# Altium schematic sheet TSK3000_Trace.SchDoc: FPGA TSK3000 Trace example
size B; Organization: Altium Limited; Address1: L3, 12a Rodborough Rd; Address2: Frenchs Forest; Address3: NSW; Address4: Australia 2086
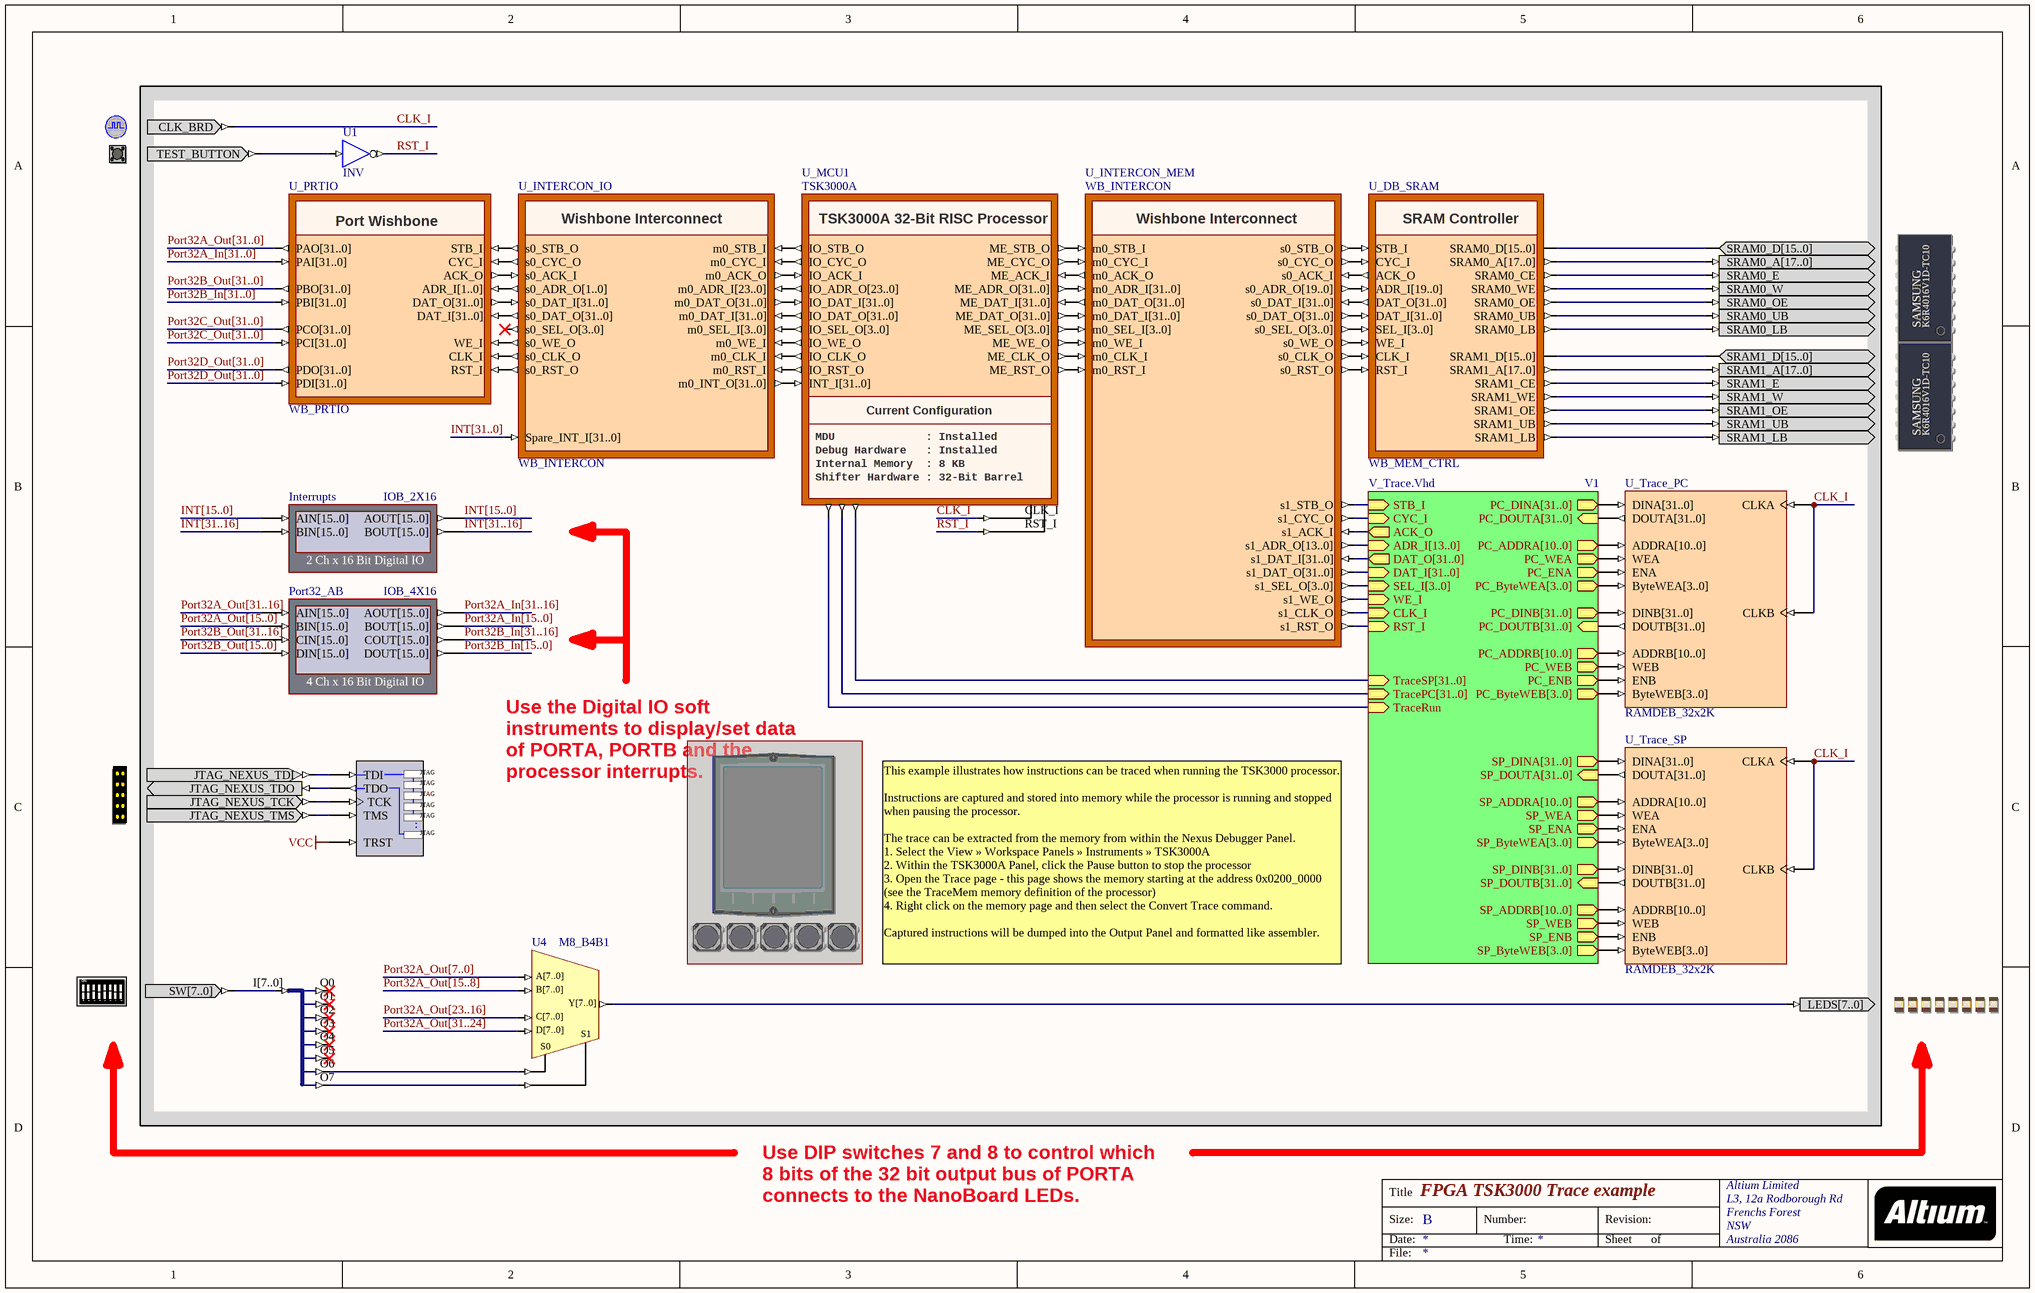
[diagram p0: TSK3000_Trace.SchDoc]

## Parts
(Parts that share a designator on the sheet are numbered #1, #2 ... from top to bottom, then left to right.)
?#1  CLOCK_BOARD  (value not drawn)
?#2  TEST_BUTTON  (value not drawn)
?#3  SRAM_DAUGHTER0  (value not drawn)
?#4  SRAM_DAUGHTER1  (value not drawn)
?#5  FIRMWARE_TFT_ENABLE  (value not drawn)  (masked out: inside a compile mask, not in the netlist)
?#6  NEXUS_JTAG_CONNECTOR  (value not drawn)
?#7  FIRMWARE_BUTTONS_ENABLE  (value not drawn)  (masked out: inside a compile mask, not in the netlist)
?#8  DIPSWITCH  (value not drawn)
?#9  LED  (value not drawn)
Interrupts  IOB_2X16
NEXUS_JTAG_PORT  NEXUS_JTAG_PORT  (value not drawn)
Port32_AB  IOB_4X16
U1  INV
U4  M8_B4B1
U11  J8B_8S  (value not drawn)
U_DB_SRAM  WB_MEM_CTRL
U_INTERCON_IO  WB_INTERCON
U_INTERCON_MEM  WB_INTERCON
U_MCU1  TSK3000A
U_PRTIO  WB_PRTIO
U_Trace_PC  RAMDEB_32x2K
U_Trace_SP  RAMDEB_32x2K

## Sub-sheets
V1 = V_Trace.Vhd: TracePC[31..0] (in), TraceRun (in), PC_DOUTA[31..0] (in), PC_DOUTB[31..0] (in), PC_ADDRA[10..0] (out), PC_ADDRB[10..0] (out), PC_DINA[31..0] (out), PC_DINB[31..0] (out), PC_WEA (out), PC_WEB (out), PC_ENA (out), PC_ENB (out), PC_ByteWEA[3..0] (out), PC_ByteWEB[3..0] (out), TraceSP[31..0] (in), SP_DOUTA[31..0] (in), SP_DINA[31..0] (out), SP_ByteWEB[3..0] (out), SP_DINB[31..0] (out), SP_ByteWEA[3..0] (out), SP_ENA (out), SP_WEB (out), SP_ENB (out), SP_DOUTB[31..0] (in), SP_ADDRB[10..0] (out), SP_WEA (out), SP_ADDRA[10..0] (out), SEL_I[3..0] (in), WE_I (in), DAT_O[31..0] (out), DAT_I[31..0] (in), ADR_I[13..0] (in), ACK_O (out), STB_I (in), CYC_I (in), RST_I (in), CLK_I (in)

## Nets
VCC: NEXUS_JTAG_PORT.TRST
CLK_I: ?#1.CLK_BRD U_MCU1.CLK_I U_Trace_PC.CLKA U_Trace_PC.CLKB U_Trace_SP.CLKA U_Trace_SP.CLKB
INT[15..0]: Interrupts.AIN[15..0] Interrupts.AOUT[15..0]
INT[31..0]: U_INTERCON_IO.Spare_INT_I[31..0]
INT[31..16]: Interrupts.BIN[15..0] Interrupts.BOUT[15..0]
Port32A_In[15..0]: Port32_AB.BOUT[15..0]
Port32A_In[31..0]: U_PRTIO.PAI[31..0]
Port32A_In[31..16]: Port32_AB.AOUT[15..0]
Port32A_Out[7..0]: U4.A[7..0]
Port32A_Out[15..0]: Port32_AB.BIN[15..0]
Port32A_Out[15..8]: U4.B[7..0]
Port32A_Out[23..16]: U4.C[7..0]
Port32A_Out[31..0]: U_PRTIO.PAO[31..0]
Port32A_Out[31..16]: Port32_AB.AIN[15..0]
Port32A_Out[31..24]: U4.D[7..0]
Port32B_In[15..0]: Port32_AB.DOUT[15..0]
Port32B_In[31..0]: U_PRTIO.PBI[31..0]
Port32B_In[31..16]: Port32_AB.COUT[15..0]
Port32B_Out[15..0]: Port32_AB.DIN[15..0]
Port32B_Out[31..0]: U_PRTIO.PBO[31..0]
Port32B_Out[31..16]: Port32_AB.CIN[15..0]
Port32C_Out[31..0]: U_PRTIO.PCI[31..0] U_PRTIO.PCO[31..0]
Port32D_Out[31..0]: U_PRTIO.PDI[31..0] U_PRTIO.PDO[31..0]
RST_I: U1.O U_MCU1.RST_I
Net?#2_TEST_BUTTON: ?#2.TEST_BUTTON U1.I
Net?#3_SRAM0_A[17..0]: ?#3.SRAM0_A[17..0] U_DB_SRAM.SRAM0_A[17..0]
Net?#3_SRAM0_D[15..0]: ?#3.SRAM0_D[15..0] U_DB_SRAM.SRAM0_D[15..0]
Net?#3_SRAM0_E: ?#3.SRAM0_E U_DB_SRAM.SRAM0_CE
Net?#3_SRAM0_LB: ?#3.SRAM0_LB U_DB_SRAM.SRAM0_LB
Net?#3_SRAM0_OE: ?#3.SRAM0_OE U_DB_SRAM.SRAM0_OE
Net?#3_SRAM0_UB: ?#3.SRAM0_UB U_DB_SRAM.SRAM0_UB
Net?#3_SRAM0_W: ?#3.SRAM0_W U_DB_SRAM.SRAM0_WE
Net?#4_SRAM1_A[17..0]: ?#4.SRAM1_A[17..0] U_DB_SRAM.SRAM1_A[17..0]
Net?#4_SRAM1_D[15..0]: ?#4.SRAM1_D[15..0] U_DB_SRAM.SRAM1_D[15..0]
Net?#4_SRAM1_E: ?#4.SRAM1_E U_DB_SRAM.SRAM1_CE
Net?#4_SRAM1_LB: ?#4.SRAM1_LB U_DB_SRAM.SRAM1_LB
Net?#4_SRAM1_OE: ?#4.SRAM1_OE U_DB_SRAM.SRAM1_OE
Net?#4_SRAM1_UB: ?#4.SRAM1_UB U_DB_SRAM.SRAM1_UB
Net?#4_SRAM1_W: ?#4.SRAM1_W U_DB_SRAM.SRAM1_WE
Net?#6_JTAG_NEXUS_TCK: ?#6.JTAG_NEXUS_TCK NEXUS_JTAG_PORT.TCK
Net?#6_JTAG_NEXUS_TDI: ?#6.JTAG_NEXUS_TDI NEXUS_JTAG_PORT.TDI
Net?#6_JTAG_NEXUS_TDO: ?#6.JTAG_NEXUS_TDO NEXUS_JTAG_PORT.TDO
Net?#6_JTAG_NEXUS_TMS: ?#6.JTAG_NEXUS_TMS NEXUS_JTAG_PORT.TMS
Net?#8_SW[7..0]: ?#8.SW[7..0] U11.I[7..0]
Net?#9_LEDS[7..0]: ?#9.LEDS[7..0] U4.Y[7..0]
NetU4_S0: U4.S0 U11.O6
NetU4_S1: U4.S1 U11.O7
NetU_DB_SRAM_ACK_O: U_DB_SRAM.ACK_O U_INTERCON_MEM.s0_ACK_I
NetU_DB_SRAM_ADR_I[19..0]: U_DB_SRAM.ADR_I[19..0] U_INTERCON_MEM.s0_ADR_O[19..0]
NetU_DB_SRAM_CLK_I: U_DB_SRAM.CLK_I U_INTERCON_MEM.s0_CLK_O
NetU_DB_SRAM_CYC_I: U_DB_SRAM.CYC_I U_INTERCON_MEM.s0_CYC_O
NetU_DB_SRAM_DAT_I[31..0]: U_DB_SRAM.DAT_I[31..0] U_INTERCON_MEM.s0_DAT_O[31..0]
NetU_DB_SRAM_DAT_O[31..0]: U_DB_SRAM.DAT_O[31..0] U_INTERCON_MEM.s0_DAT_I[31..0]
NetU_DB_SRAM_RST_I: U_DB_SRAM.RST_I U_INTERCON_MEM.s0_RST_O
NetU_DB_SRAM_SEL_I[3..0]: U_DB_SRAM.SEL_I[3..0] U_INTERCON_MEM.s0_SEL_O[3..0]
NetU_DB_SRAM_STB_I: U_DB_SRAM.STB_I U_INTERCON_MEM.s0_STB_O
NetU_DB_SRAM_WE_I: U_DB_SRAM.WE_I U_INTERCON_MEM.s0_WE_O
NetU_INTERCON_IO_m0_ACK_O: U_INTERCON_IO.m0_ACK_O U_MCU1.IO_ACK_I
NetU_INTERCON_IO_m0_ADR_I[23..0]: U_INTERCON_IO.m0_ADR_I[23..0] U_MCU1.IO_ADR_O[23..0]
NetU_INTERCON_IO_m0_CLK_I: U_INTERCON_IO.m0_CLK_I U_MCU1.IO_CLK_O
NetU_INTERCON_IO_m0_CYC_I: U_INTERCON_IO.m0_CYC_I U_MCU1.IO_CYC_O
NetU_INTERCON_IO_m0_DAT_I[31..0]: U_INTERCON_IO.m0_DAT_I[31..0] U_MCU1.IO_DAT_O[31..0]
NetU_INTERCON_IO_m0_DAT_O[31..0]: U_INTERCON_IO.m0_DAT_O[31..0] U_MCU1.IO_DAT_I[31..0]
NetU_INTERCON_IO_m0_INT_O[31..0]: U_INTERCON_IO.m0_INT_O[31..0] U_MCU1.INT_I[31..0]
NetU_INTERCON_IO_m0_RST_I: U_INTERCON_IO.m0_RST_I U_MCU1.IO_RST_O
NetU_INTERCON_IO_m0_SEL_I[3..0]: U_INTERCON_IO.m0_SEL_I[3..0] U_MCU1.IO_SEL_O[3..0]
NetU_INTERCON_IO_m0_STB_I: U_INTERCON_IO.m0_STB_I U_MCU1.IO_STB_O
NetU_INTERCON_IO_m0_WE_I: U_INTERCON_IO.m0_WE_I U_MCU1.IO_WE_O
NetU_INTERCON_IO_s0_ACK_I: U_INTERCON_IO.s0_ACK_I U_PRTIO.ACK_O
NetU_INTERCON_IO_s0_ADR_O[1..0]: U_INTERCON_IO.s0_ADR_O[1..0] U_PRTIO.ADR_I[1..0]
NetU_INTERCON_IO_s0_CLK_O: U_INTERCON_IO.s0_CLK_O U_PRTIO.CLK_I
NetU_INTERCON_IO_s0_CYC_O: U_INTERCON_IO.s0_CYC_O U_PRTIO.CYC_I
NetU_INTERCON_IO_s0_DAT_I[31..0]: U_INTERCON_IO.s0_DAT_I[31..0] U_PRTIO.DAT_O[31..0]
NetU_INTERCON_IO_s0_DAT_O[31..0]: U_INTERCON_IO.s0_DAT_O[31..0] U_PRTIO.DAT_I[31..0]
NetU_INTERCON_IO_s0_RST_O: U_INTERCON_IO.s0_RST_O U_PRTIO.RST_I
NetU_INTERCON_IO_s0_STB_O: U_INTERCON_IO.s0_STB_O U_PRTIO.STB_I
NetU_INTERCON_IO_s0_WE_O: U_INTERCON_IO.s0_WE_O U_PRTIO.WE_I
NetU_INTERCON_MEM_m0_ACK_O: U_INTERCON_MEM.m0_ACK_O U_MCU1.ME_ACK_I
NetU_INTERCON_MEM_m0_ADR_I[31..0]: U_INTERCON_MEM.m0_ADR_I[31..0] U_MCU1.ME_ADR_O[31..0]
NetU_INTERCON_MEM_m0_CLK_I: U_INTERCON_MEM.m0_CLK_I U_MCU1.ME_CLK_O
NetU_INTERCON_MEM_m0_CYC_I: U_INTERCON_MEM.m0_CYC_I U_MCU1.ME_CYC_O
NetU_INTERCON_MEM_m0_DAT_I[31..0]: U_INTERCON_MEM.m0_DAT_I[31..0] U_MCU1.ME_DAT_O[31..0]
NetU_INTERCON_MEM_m0_DAT_O[31..0]: U_INTERCON_MEM.m0_DAT_O[31..0] U_MCU1.ME_DAT_I[31..0]
NetU_INTERCON_MEM_m0_RST_I: U_INTERCON_MEM.m0_RST_I U_MCU1.ME_RST_O
NetU_INTERCON_MEM_m0_SEL_I[3..0]: U_INTERCON_MEM.m0_SEL_I[3..0] U_MCU1.ME_SEL_O[3..0]
NetU_INTERCON_MEM_m0_STB_I: U_INTERCON_MEM.m0_STB_I U_MCU1.ME_STB_O
NetU_INTERCON_MEM_m0_WE_I: U_INTERCON_MEM.m0_WE_I U_MCU1.ME_WE_O
NetU_INTERCON_MEM_s1_ACK_I: U_INTERCON_MEM.s1_ACK_I ; sheet V1/ACK_O
NetU_INTERCON_MEM_s1_ADR_O[13..0]: U_INTERCON_MEM.s1_ADR_O[13..0] ; sheet V1/ADR_I[13..0]
NetU_INTERCON_MEM_s1_CLK_O: U_INTERCON_MEM.s1_CLK_O ; sheet V1/CLK_I
NetU_INTERCON_MEM_s1_CYC_O: U_INTERCON_MEM.s1_CYC_O ; sheet V1/CYC_I
NetU_INTERCON_MEM_s1_DAT_I[31..0]: U_INTERCON_MEM.s1_DAT_I[31..0] ; sheet V1/DAT_O[31..0]
NetU_INTERCON_MEM_s1_DAT_O[31..0]: U_INTERCON_MEM.s1_DAT_O[31..0] ; sheet V1/DAT_I[31..0]
NetU_INTERCON_MEM_s1_RST_O: U_INTERCON_MEM.s1_RST_O ; sheet V1/RST_I
NetU_INTERCON_MEM_s1_SEL_O[3..0]: U_INTERCON_MEM.s1_SEL_O[3..0] ; sheet V1/SEL_I[3..0]
NetU_INTERCON_MEM_s1_STB_O: U_INTERCON_MEM.s1_STB_O ; sheet V1/STB_I
NetU_INTERCON_MEM_s1_WE_O: U_INTERCON_MEM.s1_WE_O ; sheet V1/WE_I
NetU_MCU1_TracePC[31..0]: U_MCU1.TracePC[31..0] ; sheet V1/TracePC[31..0]
NetU_MCU1_TraceRun: U_MCU1.TraceRun ; sheet V1/TraceRun
NetU_MCU1_TraceSP[31..0]: U_MCU1.TraceSP[31..0] ; sheet V1/TraceSP[31..0]
NetU_Trace_PC_ADDRA[10..0]: U_Trace_PC.ADDRA[10..0] ; sheet V1/PC_ADDRA[10..0]
NetU_Trace_PC_ADDRB[10..0]: U_Trace_PC.ADDRB[10..0] ; sheet V1/PC_ADDRB[10..0]
NetU_Trace_PC_ByteWEA[3..0]: U_Trace_PC.ByteWEA[3..0] ; sheet V1/PC_ByteWEA[3..0]
NetU_Trace_PC_ByteWEB[3..0]: U_Trace_PC.ByteWEB[3..0] ; sheet V1/PC_ByteWEB[3..0]
NetU_Trace_PC_DINA[31..0]: U_Trace_PC.DINA[31..0] ; sheet V1/PC_DINA[31..0]
NetU_Trace_PC_DINB[31..0]: U_Trace_PC.DINB[31..0] ; sheet V1/PC_DINB[31..0]
NetU_Trace_PC_DOUTA[31..0]: U_Trace_PC.DOUTA[31..0] ; sheet V1/PC_DOUTA[31..0]
NetU_Trace_PC_DOUTB[31..0]: U_Trace_PC.DOUTB[31..0] ; sheet V1/PC_DOUTB[31..0]
NetU_Trace_PC_ENA: U_Trace_PC.ENA ; sheet V1/PC_ENA
NetU_Trace_PC_ENB: U_Trace_PC.ENB ; sheet V1/PC_ENB
NetU_Trace_PC_WEA: U_Trace_PC.WEA ; sheet V1/PC_WEA
NetU_Trace_PC_WEB: U_Trace_PC.WEB ; sheet V1/PC_WEB
NetU_Trace_SP_ADDRA[10..0]: U_Trace_SP.ADDRA[10..0] ; sheet V1/SP_ADDRA[10..0]
NetU_Trace_SP_ADDRB[10..0]: U_Trace_SP.ADDRB[10..0] ; sheet V1/SP_ADDRB[10..0]
NetU_Trace_SP_ByteWEA[3..0]: U_Trace_SP.ByteWEA[3..0] ; sheet V1/SP_ByteWEA[3..0]
NetU_Trace_SP_ByteWEB[3..0]: U_Trace_SP.ByteWEB[3..0] ; sheet V1/SP_ByteWEB[3..0]
NetU_Trace_SP_DINA[31..0]: U_Trace_SP.DINA[31..0] ; sheet V1/SP_DINA[31..0]
NetU_Trace_SP_DINB[31..0]: U_Trace_SP.DINB[31..0] ; sheet V1/SP_DINB[31..0]
NetU_Trace_SP_DOUTA[31..0]: U_Trace_SP.DOUTA[31..0] ; sheet V1/SP_DOUTA[31..0]
NetU_Trace_SP_DOUTB[31..0]: U_Trace_SP.DOUTB[31..0] ; sheet V1/SP_DOUTB[31..0]
NetU_Trace_SP_ENA: U_Trace_SP.ENA ; sheet V1/SP_ENA
NetU_Trace_SP_ENB: U_Trace_SP.ENB ; sheet V1/SP_ENB
NetU_Trace_SP_WEA: U_Trace_SP.WEA ; sheet V1/SP_WEA
NetU_Trace_SP_WEB: U_Trace_SP.WEB ; sheet V1/SP_WEB

Not connected (* = marked no-connect by the designer): U11 O0* O1* O2* O3* O4* O5*; U_INTERCON_IO s0_SEL_O[3..0]*

## Buses and harness runs
bus INT[15..0]
bus INT[31..0]
bus INT[31..16]
bus Port32A_In[15..0]
bus Port32A_In[31..0]
bus Port32A_In[31..16]
bus Port32A_Out[7..0]
bus Port32A_Out[15..0]
bus Port32A_Out[15..8]
bus Port32A_Out[23..16]
bus Port32A_Out[31..0]
bus Port32A_Out[31..16]
bus Port32A_Out[31..24]
bus Port32B_In[15..0]
bus Port32B_In[31..0]
bus Port32B_In[31..16]
bus Port32B_Out[15..0]
bus Port32B_Out[31..0]
bus Port32B_Out[31..16]
bus Port32C_Out[31..0]
bus Port32D_Out[31..0]

## Notes on the sheet
- Use the Digital IO soft instruments to display/set data of PORTA, PORTB and the processor interrupts.
- This example illustrates how instructions can be traced when running the TSK3000 processor.
  Instructions are captured and stored into memory while the processor is running and stopped when pausing the processor.
  The trace can be extracted from the memory from within the Nexus Debugger Panel.
  1. Select the View » Workspace Panels » Instruments » TSK3000A
  2. Within the TSK3000A Panel, click the Pause button to stop the processor
  3. Open the Trace page - this page shows the memory starting at the address 0x0200_0000 (see the TraceMem memory definition of the processor)
  4. Right click on the memory page and then select the Convert Trace command.
  Captured instructions will be dumped into the Output Panel and formatted like assembler.
- Use DIP switches 7 and 8 to control which 8 bits of the 32 bit output bus of PORTA connects to the NanoBoard LEDs.
- Title
- Size:
- Date:
- B
- Number:
- Time:
- Revision:
- Sheet
- of
- File:
- (in symbol DIPSWITCH) ON; 1; 2; 3; 4; 5; 6; 7; 8
- (in symbol NEXUS_JTAG_PORT) JTAG; .
- (in symbol SRAM_DAUGHTER0) SAMSUNG; K6R4016V1D-TC10
- (in symbol SRAM_DAUGHTER1) SAMSUNG; K6R4016V1D-TC10
- (in symbol TSK3000A) TSK3000A 32-Bit RISC Processor; Current Configuration; MDU              : Installed; Debug Hardware   : Installed; Internal Memory  : 8 KB; Shifter Hardware : 32-Bit Barrel
- (in symbol WB_INTERCON) Wishbone Interconnect
- (in symbol WB_MEM_CTRL) SRAM Controller
- (in symbol WB_PRTIO) Port Wishbone

## Library data of the parts
?#1 = CLOCK_BOARD: Global System Clock Supply; PortComponent: True; Published: 19-Nov-2003; Publisher: Altium Limited; HelpURL: TR0143 Technical Reference Manual for Altium's Desktop NanoBoard NB2DSK01.pdf#page=41; UseInDSF: True
?#2 = TEST_BUTTON: Test / Reset Button; PortComponent: True; Published: 19-Nov-2003; Publisher: Altium Limited; HelpURL: TR0143 Technical Reference Manual for Altium's Desktop NanoBoard NB2DSK01.pdf#page=53
?#3 = SRAM_DAUGHTER0: Free Static RAM - Daughterboard; PortComponent: True; Published: 14-May-2007; Publisher: Altium Limited; HelpURL: TR0149 Technical Reference for Altium's Xilinx Spartan-3 Daughter Board DB30.pdf#page=16
?#4 = SRAM_DAUGHTER1: Free Static RAM - Daughterboard; PortComponent: True; Published: 14-May-2007; Publisher: Altium Limited; HelpURL: TR0149 Technical Reference for Altium's Xilinx Spartan-3 Daughter Board DB30.pdf#page=16
?#5 = FIRMWARE_TFT_ENABLE: TFT LCD Panel; PortComponent: True; Published: 22-Jan-2007; Publisher: Altium Limited; HelpURL: TR0143 Technical Reference Manual for Altium's Desktop NanoBoard NB2DSK01.pdf#page=50
?#6 = NEXUS_JTAG_CONNECTOR: JTAG Port; PortComponent: True; Published: 19-Nov-2003; Publisher: Altium Limited; HelpURL: TR0102 NanoBoard Technical Reference Manual - NB1.pdf#page=33
?#7 = FIRMWARE_BUTTONS_ENABLE: Generic User Buttons; PortComponent: True; Published: 16-Apr-2007; Publisher: Altium Limited; HelpURL: TR0143 Technical Reference Manual for Altium's Desktop NanoBoard NB2DSK01.pdf#page=53
?#8 = DIPSWITCH: 8-Way Dip-Switch; PortComponent: True; Published: 19-Nov-2003; Publisher: Altium Limited; HelpURL: TR0143 Technical Reference Manual for Altium's Desktop NanoBoard NB2DSK01.pdf#page=51
?#9 = LED: Bank of eight Red LEDs; PortComponent: True; Published: 19-Nov-2003; Publisher: Altium Limited; HelpURL: TR0143 Technical Reference Manual for Altium's Desktop NanoBoard NB2DSK01.pdf#page=51
Interrupts = IOB_2X16: 2 Ch x 16 Bit Digital IO; NEXUS_CORE: Instrument; NEXUS_JTAG_DEVICE: True; NEXUS_JTAG_ORDER: 20; Published: 30/09/2003; Publisher: Altium Hobart Technology Centre; ComponentLink1Description: Core &Resource Usage; ComponentLink1URL: CR0134 FPGA Instrument Resource Usage.pdf#page=7; HelpURL: CR0102 IOB_x Digital IO Module.pdf#page=2; LastRevisionNo: 1.00.00
NEXUS_JTAG_PORT = NEXUS_JTAG_PORT: Soft Nexus-Chain Connector; NEXUS_JTAG_CONNECTOR: True; Published: 18-Dec-2003; Publisher: Altium Limited
Port32_AB = IOB_4X16: 4 Ch x 16 Bit Digital IO; NEXUS_CORE: Instrument; NEXUS_JTAG_DEVICE: True; NEXUS_JTAG_ORDER: 30; Published: 30/09/2003; Publisher: Altium Hobart Technology Centre; ComponentLink1Description: Core &Resource Usage; ComponentLink1URL: CR0134 FPGA Instrument Resource Usage.pdf#page=9; HelpURL: CR0102 IOB_x Digital IO Module.pdf#page=2; LastRevisionNo: 1.00.00
U1 = INV: Inverter; ArchiveName: GENERIC; FunctionalClass: Logic Primitive; VHDLIB_SIM: GENERIC_LIB; Published: 18-Dec-2003; Publisher: Altium Limited; ComponentLink1Description: Core &Resource Usage; ComponentLink1URL: CR0136 FPGA Logic Primitive Resource Usage.pdf#page=61; HelpURL: CR0118 FPGA Generic Library Guide.pdf#page=290; LastRevisionNo: 1.00.00; SubClass: INV; XilinxEquivalent: INV
U4 = M8_B4B1: 4x8-Bit Bus to 1x8-Bit Bus Multiplexer; ArchiveName: GENERIC; VHDLIB_SIM: GENERIC_LIB; PortSize: 8; PortStyle: Bus Version; SubClass: BnB1; Published: 29-Jan-2004; Publisher: Altium Limited; HelpURL: CR0118 FPGA Generic Library Guide.pdf#page=364; ComponentLink1Description: Core &Resource Usage; ComponentLink1URL: CR0137 FPGA Multiplexer Resource Usage.pdf#page=304; FunctionalClass: Multiplexer; LastRevisionNo: 1.00.00
U11 = J8B_8S: 8-Bit input bus to 8 single pin outputs; ArchiveName: GENERIC; VHDLIB_SIM: GENERIC_LIB; FunctionalClass: Bus Joiner; PortSize: 8; Published: 29-Jan-2004; Publisher: Altium Limited; ComponentLink1Description: Core &Resource Usage; ComponentLink1URL: CR0126 FPGA Bus Joiner Resource Usage.pdf#page=27; HelpURL: CR0118 FPGA Generic Library Guide.pdf#page=303; LastRevisionNo: 1.00.00
U_DB_SRAM = WB_MEM_CTRL: Configurable Memory Controller; ConfigurationParameters: {}Version[1.0]{}Option_MemoryType[Asynchronous SRAM]{}Option_MemorySize[1 MB (256K x 32-bit)]{}Option_Layout[2 x 16-bit Wide Devices]{}Option_Read[2]{}Option_WriteSetup[1]{}Option_WritePulse[1]{}Option_WriteHold[1]{}Option_FlashRead[4]{}Option_FlashWriteSetup[1]{}Option_FlashWritePulse[5]{}Option_FlashWriteHold[1]{}Option_SdramKeepRowOpen[0]{}Option_SdramClock[100]{}Option_SdramWriteRecovery[4]{}Option_SdramAutoRefresh[16]{}Option_SdramActiveToReadWrite[8]{}Option_SdramPrecharge[16]{}Option_SdramCasLatency[2]{}Option_SdramClockScheme[0]{}; ComponentLink1Description: Core &Resource Usage; ComponentLink1URL: CR0139 FPGA Peripheral Resource Usage.pdf#page=58; HelpURL: CR0152 WB_MEM_CTRL Configurable Wishbone Memory Controller.pdf#page=2; LastRevisionNo: 1.00.00; Published: 9-Dec-2004; Publisher: Altium Limited; ConfiguratorName: WB_MEM_CTRL
U_INTERCON_IO = WB_INTERCON: Configurable Wishbone Interconnect; ConfigurationParameters: {}UnusedInterrupts[0]{}MasterAddressBits[1]{}Name0[Port32]{}Kind0[0]{}SpaceAfter0[4]{}Address_Base0[0]{}Address_UsedRange0[4]{}Address_Bits0[2]{}Address_Mode0[0]{}Address_DecodeWidth0[4]{}DataWidth0[0]{}UsedInterrupts0[]; ComponentLink1Description: Core &Resource Usage; ComponentLink1URL: CR0139 FPGA Peripheral Resource Usage.pdf#page=51; HelpURL: CR0150 WB_INTERCON Configurable Wishbone Interconnect.pdf#page=2; LastRevisionNo: 1.00.00; Published: 9-Dec-2004; Publisher: Altium Limited; ConfiguratorName: WB_INTERCON
U_INTERCON_MEM = WB_INTERCON: Configurable Wishbone Interconnect; ConfigurationParameters: {}Version[1.0]{}UnusedInterrupts[2]{}MasterAddressBits[0]{}Name0[DB_SRAM]{}Kind0[2]{}SpaceAfter0[9]{}Address_Base0[16777216]{}Address_Bits0[20]{}Address_Mode0[1]{}Address_DecodeWidth0[8]{}DataWidth0[0]{}UsedInterrupts0[ ]{}Name1[TraceMem]{}Kind1[3]{}SpaceAfter1[4]{}Address_Base1[33554432]{}Address_Bits1[14]{}Address_Mode1[1]{}Address_DecodeWidth1[8]{}DataWidth1[0]{}UsedInterrupts1[ ]; ComponentLink1Description: Core &Resource Usage; ComponentLink1URL: CR0139 FPGA Peripheral Resource Usage.pdf#page=51; HelpURL: CR0150 WB_INTERCON Configurable Wishbone Interconnect.pdf#page=2; LastRevisionNo: 1.00.00; Published: 9-Dec-2004; Publisher: Altium Limited; ConfiguratorName: WB_INTERCON
U_MCU1 = TSK3000A: TSK3000A OCD Microprocessor; ChildModel1: TSK3000A_MCU; Nexus_JTAG_Device: True; Nexus_Core: Processor_OCDS; Nexus_JTAG_Order: 10; ProgramLogicalTopAddress: 0; ChildModel2: TSK3000A_MDU; ChildModel3: TSK3000A_OCDS; ChildModel4: TSK3000A_Shift_Barrel; ChildModel5: TSK3000A_Shift_Sequential; ChildModel6: Mult_32x32; ConfigurationParameters: {}Option_Memory[3]{}Option_MDU[0]{}Option_OCDS[0]{}Option_Shifter[0]{}Option_InterruptCount[32]{}Option_InterruptCount[32]{}; ChildModel7: m33x33; Memory_Configuration: Record[PERIPHERAL]{}ComponentDesignator[Port32]{}Memory_Depth[0x0004]{}Memory_UsageType[ram]{}ProgramDownloadAddress[0xFF000000]{}Memory_BusType[TSK3000:addr_bus]{}Memory_Mau[8]{}Memory_MatchedComponent[]{}Memory_Description[U_INTERCON_IO]{}Memory_FillBitPattern[]{}Memory_Interrupts[]{n}Record[CODE_EXPORT]{}ExportType[0]{n}Record[NEXUS_CORE]{}ComponentDesignator[Internal]{}Memory_Depth[8192]{}Memory_UsageType[rom]{}ProgramDownloadAddress[0]{}Memory_BusType[TSK3000:addr_bus]{}Memory_Mau[8]{}Memory_MatchedComponent[]{}Memory_Description[]{}Memory_FillBitPattern[]{}Memory_Interrupts[]{n}Record[NEXUS_CORE]{}ComponentDesignator[DB_SRAM]{}Memory_Depth[0x200000]{}Memory_UsageType[ram]{}ProgramDownloadAddress[0x1000000]{}Memory_BusType[TSK3000:addr_bus]{}Memory_Mau[8]{}Memory_MatchedComponent[]{}Memory_Description[U_INTERCON_MEM]{}Memory_FillBitPattern[]{}Memory_Interrupts[]{n}Record[NEXUS_CORE]{}ComponentDesignator[TraceMem]{}Memory_Depth[0x4000]{}Memory_UsageType[ram]{}ProgramDownloadAddress[0x2000000]{}Memory_BusType[TSK3000:addr_bus]{}Memory_Mau[8]{}Memory_MatchedComponent[]{}Memory_Description[U_INTERCON_MEM]{}Memory_FillBitPattern[]{}Memory_Interrupts[]{n}; ConfiguratorName: FPGA_MCU32
U_PRTIO = WB_PRTIO: Configurable Port Wishbone; ChildModel: PRTIO4X32_W; ConfigurationParameters: {}PortCount[4]{}BusWidth[32]{}PortKind[0]{}; UseInDSF: True; ComponentLink1Description: Core &Resource Usage; ComponentLink1URL: CR0139 FPGA Peripheral Resource Usage.pdf#page=63; HelpURL: CR0154 WB_PRTIO Configurable Wishbone Parallel Port Unit.pdf#page=2; LastRevisionNo: 1.00.00; Published: 9-Dec-2004; Publisher: Altium Limited; ConfiguratorName: WB_PRTIO
U_Trace_PC U_Trace_SP = RAMDEB_32x2K: Dual Port RAM, Enable, Byte Write Enable; Memory_Type: RAM_DualPortBlock; Memory_ClockEdge: Rising; Nexus_Core: Memory_Program; Memory_EnablePin: True; Memory_DepthA: 2048; Memory_WidthA: 32; Published: 11/10/2004; Publisher: Altium Hobart Technology Center; Memory_ByteWrites: True; Memory_DepthB: 2048; Memory_WidthB: 32